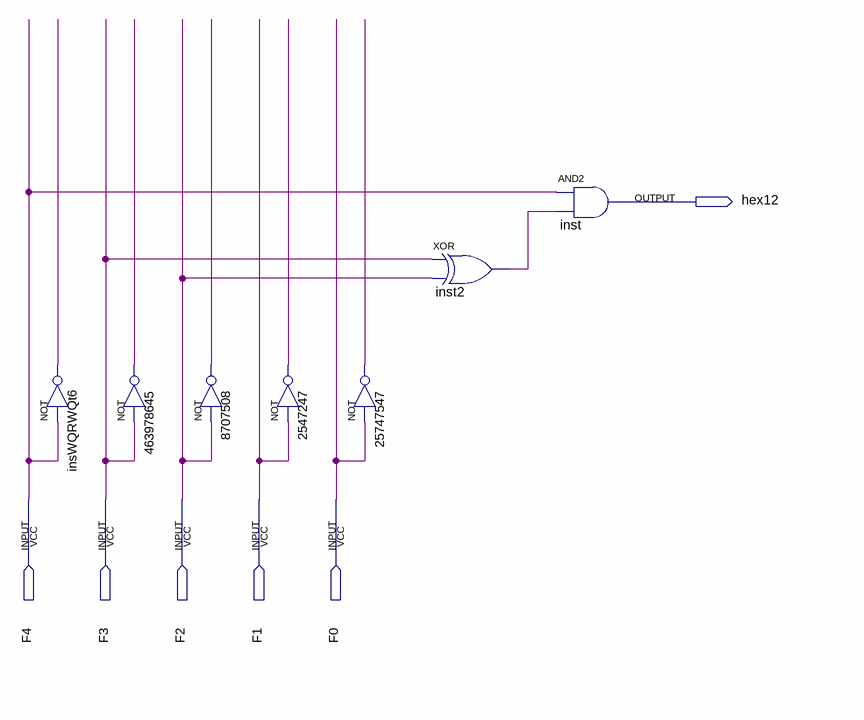
[diagram p0: schematic sheet]
// Quartus schematic HEX1[2].bdf as structural Verilog: 7 symbols, 6 pins
module \HEX1[2]  (
  input  F4,
  input  F3,
  input  F2,
  input  F1,
  input  F0,
  output hex12
);

  wire inst2_out, insWQRWQt6_out, n2547247_out, n8707508_out, n25747547_out, n463978645_out;

  not insWQRWQt6 (insWQRWQt6_out, F4);
  not u_463978645 (n463978645_out, F3);
  not u_8707508 (n8707508_out, F2);
  not u_2547247 (n2547247_out, F1);
  not u_25747547 (n25747547_out, F0);
  xor inst2 (inst2_out, F3, F2);
  and inst (hex12, F4, inst2_out);
endmodule
